# Altium schematic sheet 008_SoC DDR & DDR4.SchDoc
size 420 x 297 mm; Page Create Date: May 29, 2006; WebSite: https://www.seeedstudio.com; Variant Name: <Core Design>; Page Number: 8; Drawing: qxn; Schematic Name: BeaglePlay; Page Size: A3; Comment: Seeed Title; Page Count: 22; Page Name: 008_SoC DDR & DDR4; Company: Seeed Studio; RevCode: v0.2; DsnPath: C:\Users\a0488739\Documents\GitHub\beagleplay\allegro\DVT\BEAGLEPLAYV020_220915.DSN; SchematicName: BeaglePlay; PageName: 008_SoC DDR & DDR4; PageSize: A3; TopSchematic: True
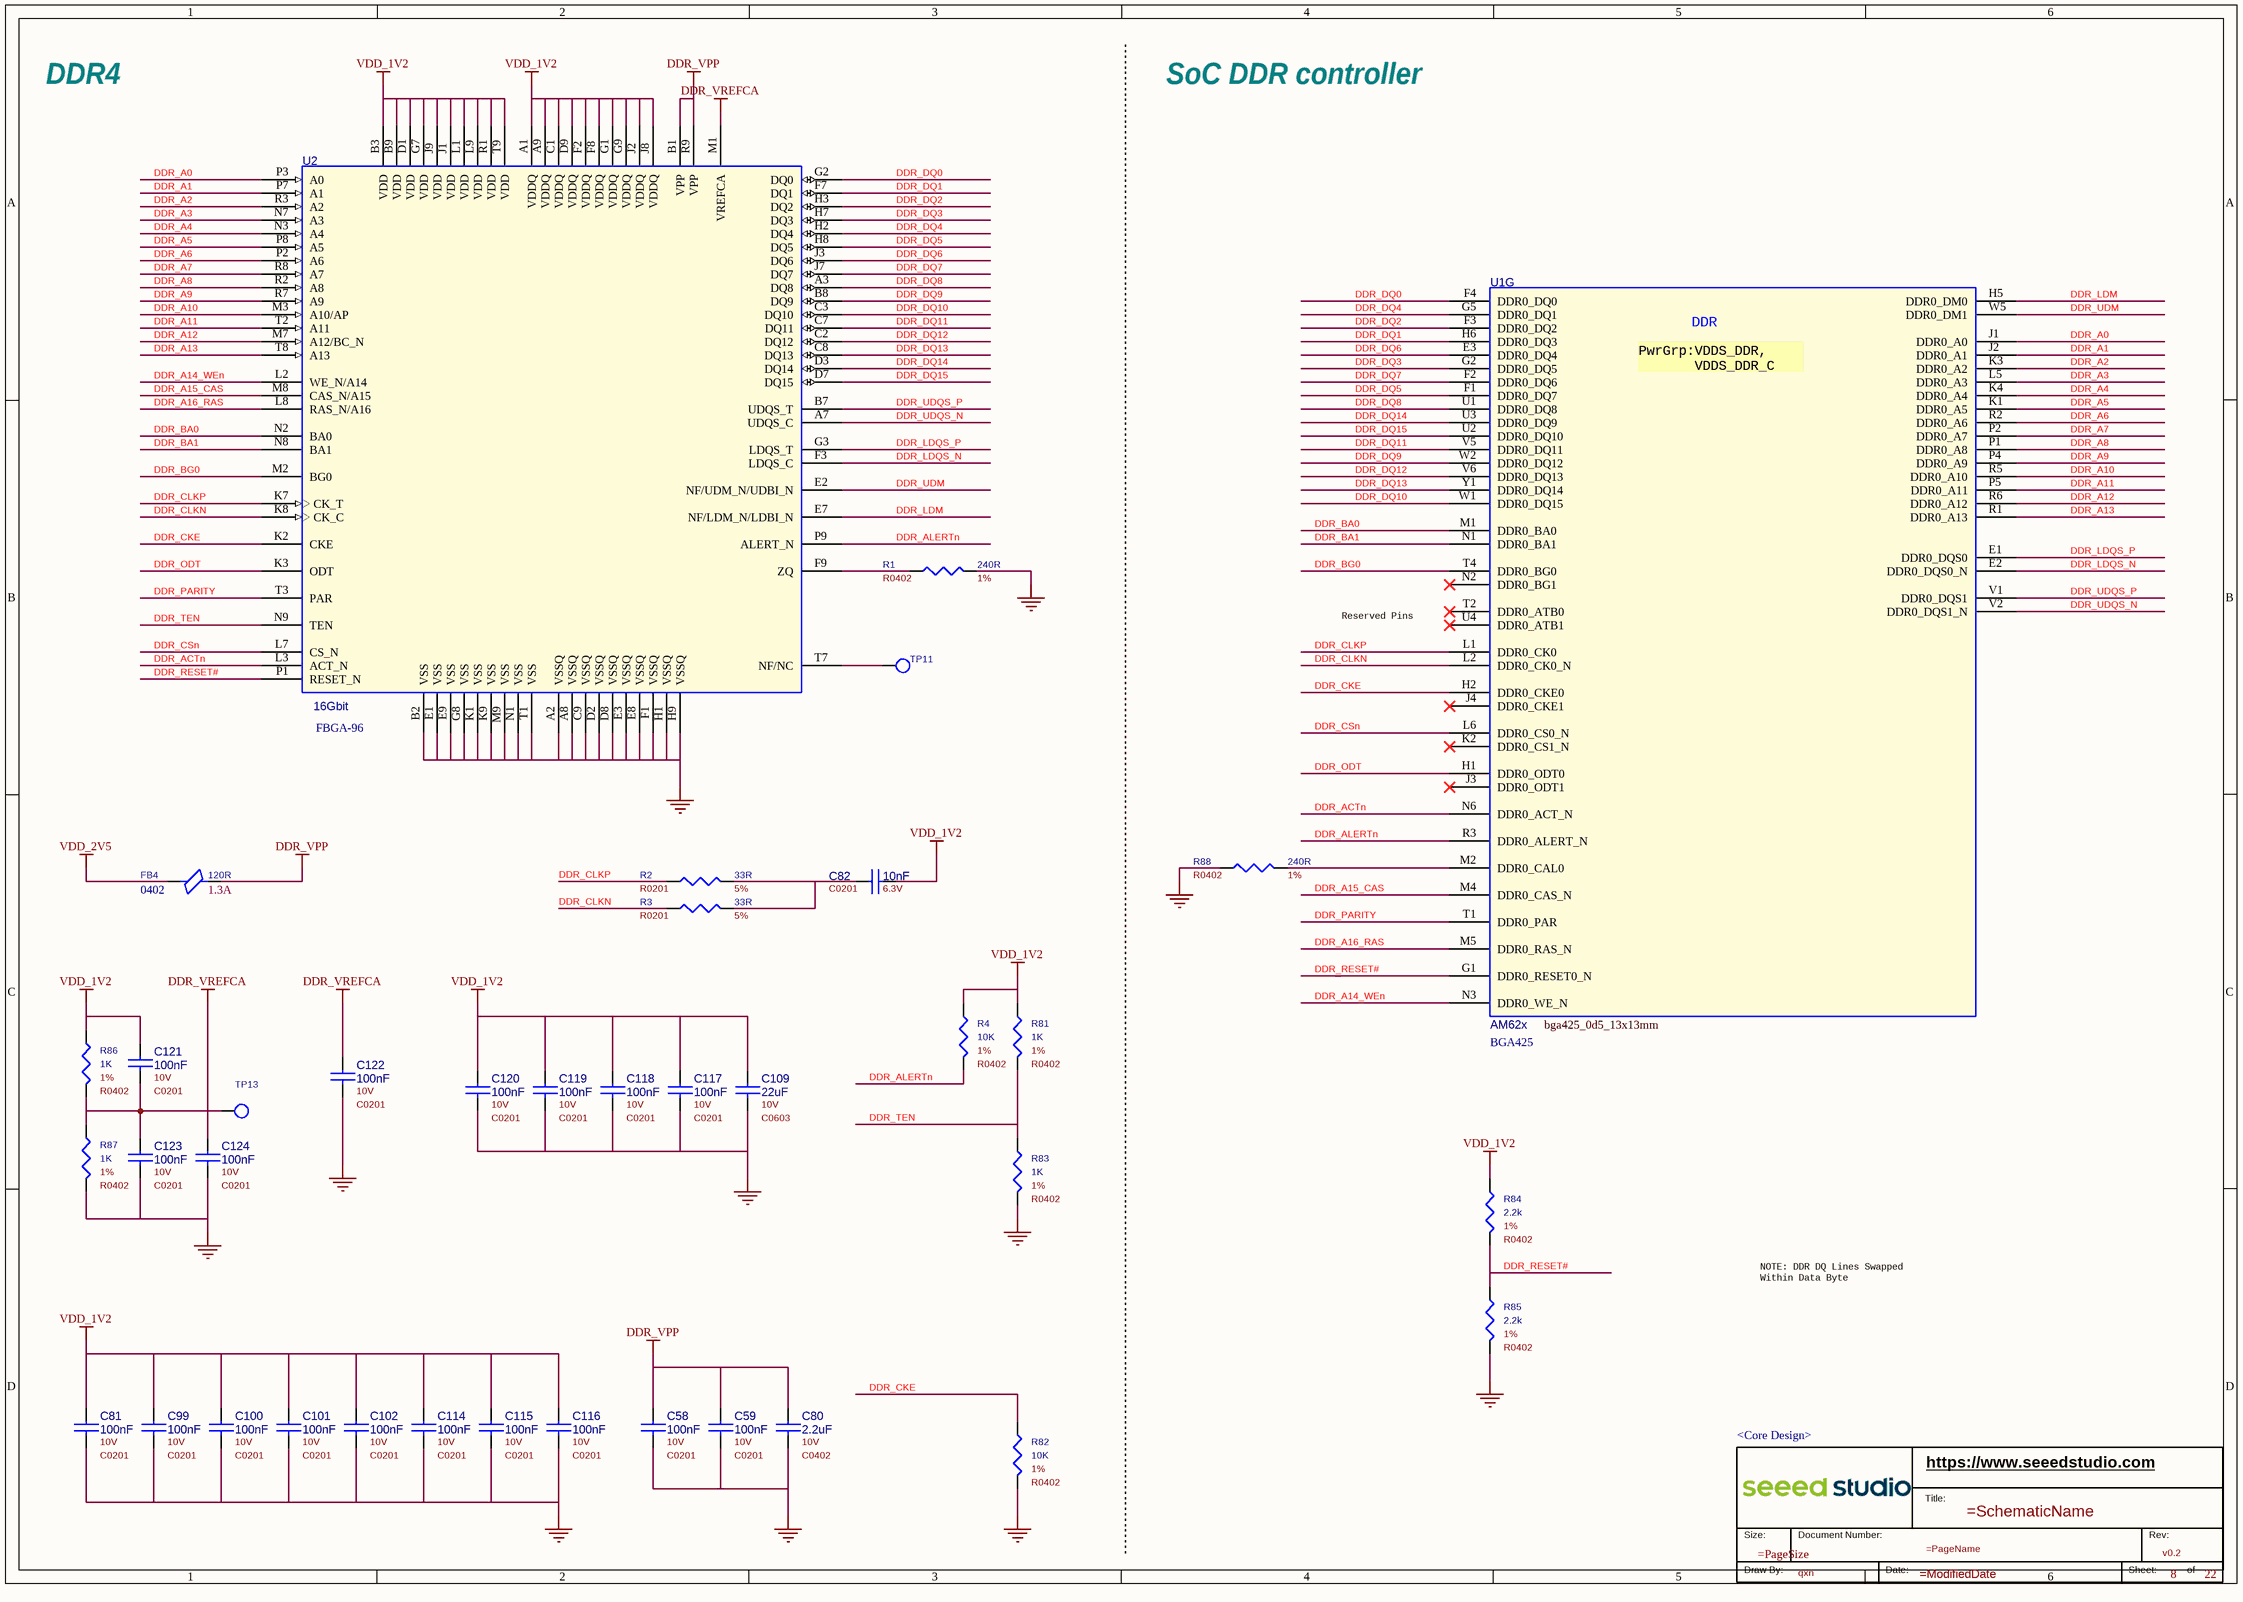
[diagram p0: 008_SoC DDR & DDR4.SchDoc]

## Parts
*  RevCode: v0.2  Page Number: 8  Page Count: 22  Drawing: qxn  Variant Name: <Core Design>  (hidden comment: Seeed Title)  (graphical)
C58  value 100nF  Rating: 10V  [C0201]  (hidden comment: CC)
C59  value 100nF  Rating: 10V  [C0201]  (hidden comment: CC)
C80  value 2.2uF  Rating: 10V  [C0402]  (hidden comment: CC)
C81  value 100nF  Rating: 10V  [C0201]  (hidden comment: CC)
C82  value 10nF  Rating: 6.3V  [C0201]  (hidden comment: CC)
C99  value 100nF  Rating: 10V  [C0201]  (hidden comment: CC)
C100  value 100nF  Rating: 10V  [C0201]  (hidden comment: CC)
C101  value 100nF  Rating: 10V  [C0201]  (hidden comment: CC)
C102  value 100nF  Rating: 10V  [C0201]  (hidden comment: CC)
C109  value 22uF  Rating: 10V  [C0603]  (hidden comment: CC)
C114  value 100nF  Rating: 10V  [C0201]  (hidden comment: CC)
C115  value 100nF  Rating: 10V  [C0201]  (hidden comment: CC)
C116  value 100nF  Rating: 10V  [C0201]  (hidden comment: CC)
C117  value 100nF  Rating: 10V  [C0201]  (hidden comment: CC)
C118  value 100nF  Rating: 10V  [C0201]  (hidden comment: CC)
C119  value 100nF  Rating: 10V  [C0201]  (hidden comment: CC)
C120  value 100nF  Rating: 10V  [C0201]  (hidden comment: CC)
C121  value 100nF  Rating: 10V  [C0201]  (hidden comment: CC)
C122  value 100nF  Rating: 10V  [C0201]  (hidden comment: CC)
C123  value 100nF  Rating: 10V  [C0201]  (hidden comment: CC)
C124  value 100nF  Rating: 10V  [C0201]  (hidden comment: CC)
FB4  value 120R  Rating: 1.3A  Package Size: 0402  [L0402]  (hidden comment: FB)
R1  value 240R  Rating: 1%  [R0402]  (hidden comment: R)
R2  value 33R  Rating: 5%  [R0201]  (hidden comment: R)
R3  value 33R  Rating: 5%  [R0201]  (hidden comment: R)
R4  value 10K  Rating: 1%  [R0402]  (hidden comment: R)
R81  value 1K  Rating: 1%  [R0402]  (hidden comment: R)
R82  value 10K  Rating: 1%  [R0402]  (hidden comment: R)
R83  value 1K  Rating: 1%  [R0402]  (hidden comment: R)
R84  value 2.2k  Rating: 1%  [R0402]  (hidden comment: R)
R85  value 2.2k  Rating: 1%  [R0402]  (hidden comment: R)
R86  value 1K  Rating: 1%  [R0402]  (hidden comment: R)
R87  value 1K  Rating: 1%  [R0402]  (hidden comment: R)
R88  value 240R  Rating: 1%  [R0402]  (hidden comment: R)
TP11  Test Point  [tp1-8040]  (value not drawn)
TP13  Test Point  [tp1-8040]  (value not drawn)
U1  value AM62x  Package Size: BGA425  [bga425_0d5_13x13mm]  (hidden comment: AM62x_BGA425)  (part G of 19)
U2  value 16Gbit  Package Size: FBGA-96  [bga96_t9_p8_10_3x13_3]  (hidden comment: DDR4_FBGA96)

## Nets
DDR_VPP: C58.1 C59.1 C80.1 FB4.2 U2.B1(VPP) U2.R9(VPP)
DDR_VREFCA: C121.2 C122.1 C123.1 C124.1 R86.2 R87.1 TP13.1(TP) U2.M1(VREFCA)
GND: C58.2 C59.2 C80.2 C81.2 C99.2 C100.2 C101.2 C102.2 C109.2 C114.2 C115.2 C116.2 C117.2 C118.2 C119.2 C120.2 C122.2 C123.2 C124.2 R1.2 R82.2 R83.2 R85.2 R87.2 R88.1 U2.A2(VSSQ) U2.A8(VSSQ) U2.B2(VSS) U2.C9(VSSQ) U2.D2(VSSQ) U2.D8(VSSQ) U2.E1(VSS) U2.E3(VSSQ) U2.E8(VSSQ) U2.E9(VSS) U2.F1(VSSQ) U2.G8(VSS) U2.H1(VSSQ) U2.H9(VSSQ) U2.K1(VSS) U2.K9(VSS) U2.M9(VSS) U2.N1(VSS) U2.T1(VSS)
VDD_1V2: C81.1 C82.2 C99.1 C100.1 C101.1 C102.1 C109.1 C114.1 C115.1 C116.1 C117.1 C118.1 C119.1 C120.1 C121.1 R4.1 R81.1 R84.1 R86.1 U2.A1(VDDQ) U2.A9(VDDQ) U2.B3(VDD) U2.B9(VDD) U2.C1(VDDQ) U2.D1(VDD) U2.D9(VDDQ) U2.F2(VDDQ) U2.F8(VDDQ) U2.G1(VDDQ) U2.G7(VDD) U2.G9(VDDQ) U2.J1(VDD) U2.J2(VDDQ) U2.J8(VDDQ) U2.J9(VDD) U2.L1(VDD) U2.L9(VDD) U2.R1(VDD) U2.T9(VDD)
VDD_2V5: FB4.1
DDR_A0: U1.J1(DDR0_A0) U2.P3(A0)
DDR_A1: U1.J2(DDR0_A1) U2.P7(A1)
DDR_A2: U1.K3(DDR0_A2) U2.R3(A2)
DDR_A3: U1.L5(DDR0_A3) U2.N7(A3)
DDR_A4: U1.K4(DDR0_A4) U2.N3(A4)
DDR_A5: U1.K1(DDR0_A5) U2.P8(A5)
DDR_A6: U1.R2(DDR0_A6) U2.P2(A6)
DDR_A7: U1.P2(DDR0_A7) U2.R8(A7)
DDR_A8: U1.P1(DDR0_A8) U2.R2(A8)
DDR_A9: U1.P4(DDR0_A9) U2.R7(A9)
DDR_A10: U1.R5(DDR0_A10) U2.M3(A10/AP)
DDR_A11: U1.P5(DDR0_A11) U2.T2(A11)
DDR_A12: U1.R6(DDR0_A12) U2.M7(A12/BC_N)
DDR_A13: U1.R1(DDR0_A13) U2.T8(A13)
DDR_A14_WEn: U1.N3(DDR0_WE_N) U2.L2(WE_N/A14)
DDR_A15_CAS: U1.M4(DDR0_CAS_N) U2.M8(CAS_N/A15)
DDR_A16_RAS: U1.M5(DDR0_RAS_N) U2.L8(RAS_N/A16)
DDR_ACTn: U1.N6(DDR0_ACT_N) U2.L3(ACT_N)
DDR_ALERTn: R4.2 U1.R3(DDR0_ALERT_N) U2.P9(ALERT_N)
DDR_BA0: U1.M1(DDR0_BA0) U2.N2(BA0)
DDR_BA1: U1.N1(DDR0_BA1) U2.N8(BA1)
DDR_BG0: U1.T4(DDR0_BG0) U2.M2(BG0)
DDR_CKE: R82.1 U1.H2(DDR0_CKE0) U2.K2(CKE)
DDR_CLKN: R3.1 U1.L2(DDR0_CK0_N) U2.K8(CK_C)
DDR_CLKP: R2.1 U1.L1(DDR0_CK0) U2.K7(CK_T)
DDR_CSn: U1.L6(DDR0_CS0_N) U2.L7(CS_N)
DDR_DQ0: U1.F4(DDR0_DQ0) U2.G2(DQ0)
DDR_DQ1: U1.H6(DDR0_DQ3) U2.F7(DQ1)
DDR_DQ2: U1.F3(DDR0_DQ2) U2.H3(DQ2)
DDR_DQ3: U1.G2(DDR0_DQ5) U2.H7(DQ3)
DDR_DQ4: U1.G5(DDR0_DQ1) U2.H2(DQ4)
DDR_DQ5: U1.F1(DDR0_DQ7) U2.H8(DQ5)
DDR_DQ6: U1.E3(DDR0_DQ4) U2.J3(DQ6)
DDR_DQ7: U1.F2(DDR0_DQ6) U2.J7(DQ7)
DDR_DQ8: U1.U1(DDR0_DQ8) U2.A3(DQ8)
DDR_DQ9: U1.W2(DDR0_DQ12) U2.B8(DQ9)
DDR_DQ10: U1.W1(DDR0_DQ15) U2.C3(DQ10)
DDR_DQ11: U1.V5(DDR0_DQ11) U2.C7(DQ11)
DDR_DQ12: U1.V6(DDR0_DQ13) U2.C2(DQ12)
DDR_DQ13: U1.Y1(DDR0_DQ14) U2.C8(DQ13)
DDR_DQ14: U1.U3(DDR0_DQ9) U2.D3(DQ14)
DDR_DQ15: U1.U2(DDR0_DQ10) U2.D7(DQ15)
DDR_LDM: U1.H5(DDR0_DM0) U2.E7(NF/LDM_N/LDBI_N)
DDR_LDQS_N: U1.E2(DDR0_DQS0_N) U2.F3(LDQS_C)
DDR_LDQS_P: U1.E1(DDR0_DQS0) U2.G3(LDQS_T)
DDR_ODT: U1.H1(DDR0_ODT0) U2.K3(ODT)
DDR_PARITY: U1.T1(DDR0_PAR) U2.T3(PAR)
DDR_RESET#: R84.2 R85.1 U1.G1(DDR0_RESET0_N) U2.P1(RESET_N)
DDR_TEN: R81.2 R83.1 U2.N9(TEN)
DDR_UDM: U1.W5(DDR0_DM1) U2.E2(NF/UDM_N/UDBI_N)
DDR_UDQS_N: U1.V2(DDR0_DQS1_N) U2.A7(UDQS_C)
DDR_UDQS_P: U1.V1(DDR0_DQS1) U2.B7(UDQS_T)
NetC82_1: C82.1 R2.2 R3.2
NetR1_1: R1.1 U2.F9(ZQ)
NetR88_2: R88.2 U1.M2(DDR0_CAL0)
NetTP11_1: TP11.1(TP) U2.T7(NF/NC)

Not connected (* = marked no-connect by the designer): U1 J3(DDR0_ODT1)* J4(DDR0_CKE1)* K2(DDR0_CS1_N)* N2(DDR0_BG1)* T2(DDR0_ATB0)* U4(DDR0_ATB1)*

## Notes on the sheet
- DDR4
- SoC DDR controller
- Reserved Pins
- NOTE: DDR DQ Lines Swapped
  Within Data Byte
- (in symbol AM62x_BGA425, part G) DDR; PwrGrp:VDDS_DDR, / VDDS_DDR_C
- (in symbol Seeed Title) https://www.seeedstudio.com; Title:; Size:; Document Number:; Rev:; Draw By:; Date:; Sheet:; of

## Library data of the parts
* = Seeed Title: Company: Seeed Studio; WebSite: https://www.seeedstudio.com; Schematic Name: =SchematicName; Page Size: =PageSize; Page Name: =PageName; Page Create Date: May 29, 2006; Page Modify Date: =ModifiedDate
C58 = CC: CAP, Ceramic, SMD, 100nF, 10%, 10V, 0201; Part Reference: C58; Manufacturer PN: CC0201KRX5R6BB104; Manufacturer: YAGEO; Company Part Status: ODYSSEY-i.MX8M; CLASS: DISCRETE; Temperature Coefficient: X5R; PN: 302010271; SIGNAL_MODEL: DEFAULT_CAPACITOR_100000pF_1_2; PCB Footprint: C0201; Tolerance: 10%; Dielectric Type: Ceramic; Package Size: 0201
C59 = CC: CAP, Ceramic, SMD, 100nF, 10%, 10V, 0201; Part Reference: C59; Company Part Status: ODYSSEY-i.MX8M; Manufacturer: YAGEO; Manufacturer PN: CC0201KRX5R6BB104; SIGNAL_MODEL: DEFAULT_CAPACITOR_100000pF_1_2; PN: 302010271; Temperature Coefficient: X5R; CLASS: DISCRETE; PCB Footprint: C0201; Package Size: 0201; Dielectric Type: Ceramic; Tolerance: 10%
C80 = CC: CAP, Ceramic, SMD, 2.2uF, 10%, 10V, 0402; Part Reference: C80; Manufacturer PN: CC0402KRX5R6BB225; Manufacturer: YAGEO; Company Part Status: BeagleConnect_Robotics_Joystick; CLASS: DISCRETE; Temperature Coefficient: X5R; PN: 302012819; PCB Footprint: C0402; Tolerance: 10%; Dielectric Type: Ceramic; Package Size: 0402
C81 = CC: CAP, Ceramic, SMD, 100nF, 10%, 10V, 0201; Part Reference: C81; Manufacturer PN: CC0201KRX5R6BB104; Manufacturer: YAGEO; Company Part Status: ODYSSEY-i.MX8M; CLASS: DISCRETE; Temperature Coefficient: X5R; PN: 302010271; SIGNAL_MODEL: DEFAULT_CAPACITOR_100000pF_1_2; PCB Footprint: C0201; Tolerance: 10%; Dielectric Type: Ceramic; Package Size: 0201
C82 = CC: CAP, Ceramic, SMD, 10nF, 10%, 6.3V, 0201; Part Reference: C82; Manufacturer PN: CC0201KRX5R5BB103; Manufacturer: YAGEO; Company Part Status: ODYSSEY-i.MX8M; CLASS: DISCRETE; Temperature Coefficient: X5R; PN: 302011831; PCB Footprint: C0201; Tolerance: 10%; Dielectric Type: Ceramic; Package Size: 0201
C99 = CC: CAP, Ceramic, SMD, 100nF, 10%, 10V, 0201; Part Reference: C99; Manufacturer PN: CC0201KRX5R6BB104; Manufacturer: YAGEO; Company Part Status: ODYSSEY-i.MX8M; CLASS: DISCRETE; Temperature Coefficient: X5R; PN: 302010271; SIGNAL_MODEL: DEFAULT_CAPACITOR_100000pF_1_2; PCB Footprint: C0201; Tolerance: 10%; Dielectric Type: Ceramic; Package Size: 0201
C100 = CC: CAP, Ceramic, SMD, 100nF, 10%, 10V, 0201; Part Reference: C100; Company Part Status: ODYSSEY-i.MX8M; Manufacturer: YAGEO; Manufacturer PN: CC0201KRX5R6BB104; SIGNAL_MODEL: DEFAULT_CAPACITOR_100000pF_1_2; PN: 302010271; Temperature Coefficient: X5R; CLASS: DISCRETE; PCB Footprint: C0201; Package Size: 0201; Dielectric Type: Ceramic; Tolerance: 10%
C101 = CC: CAP, Ceramic, SMD, 100nF, 10%, 10V, 0201; Part Reference: C101; Manufacturer PN: CC0201KRX5R6BB104; Manufacturer: YAGEO; Company Part Status: ODYSSEY-i.MX8M; CLASS: DISCRETE; Temperature Coefficient: X5R; PN: 302010271; SIGNAL_MODEL: DEFAULT_CAPACITOR_100000pF_1_2; PCB Footprint: C0201; Tolerance: 10%; Dielectric Type: Ceramic; Package Size: 0201
C102 = CC: CAP, Ceramic, SMD, 100nF, 10%, 10V, 0201; Part Reference: C102; Manufacturer PN: CC0201KRX5R6BB104; Manufacturer: YAGEO; Company Part Status: ODYSSEY-i.MX8M; CLASS: DISCRETE; Temperature Coefficient: X5R; PN: 302010271; SIGNAL_MODEL: DEFAULT_CAPACITOR_100000pF_1_2; PCB Footprint: C0201; Tolerance: 10%; Dielectric Type: Ceramic; Package Size: 0201
C109 = CC: CAP, Ceramic, SMD, 22uF, 20%, 10V, 0603; Part Reference: C109; Manufacturer PN: CC0603MRX5R6BB226; Manufacturer: YAGEO; CLASS: DISCRETE; Temperature Coefficient: X5R; PN: 302010411; PCB Footprint: C0603; Tolerance: 20%; Dielectric Type: Ceramic; Package Size: 0603
C114 = CC: CAP, Ceramic, SMD, 100nF, 10%, 10V, 0201; Part Reference: C114; Manufacturer PN: CC0201KRX5R6BB104; Manufacturer: YAGEO; Company Part Status: ODYSSEY-i.MX8M; CLASS: DISCRETE; Temperature Coefficient: X5R; PN: 302010271; SIGNAL_MODEL: DEFAULT_CAPACITOR_100000pF_1_2; PCB Footprint: C0201; Tolerance: 10%; Dielectric Type: Ceramic; Package Size: 0201
C115 = CC: CAP, Ceramic, SMD, 100nF, 10%, 10V, 0201; Part Reference: C115; Manufacturer PN: CC0201KRX5R6BB104; Manufacturer: YAGEO; Company Part Status: ODYSSEY-i.MX8M; CLASS: DISCRETE; Temperature Coefficient: X5R; PN: 302010271; SIGNAL_MODEL: DEFAULT_CAPACITOR_100000pF_1_2; PCB Footprint: C0201; Tolerance: 10%; Dielectric Type: Ceramic; Package Size: 0201
C116 = CC: CAP, Ceramic, SMD, 100nF, 10%, 10V, 0201; Part Reference: C116; Company Part Status: ODYSSEY-i.MX8M; Manufacturer: YAGEO; Manufacturer PN: CC0201KRX5R6BB104; SIGNAL_MODEL: DEFAULT_CAPACITOR_100000pF_1_2; PN: 302010271; Temperature Coefficient: X5R; CLASS: DISCRETE; PCB Footprint: C0201; Package Size: 0201; Dielectric Type: Ceramic; Tolerance: 10%
C117 = CC: CAP, Ceramic, SMD, 100nF, 10%, 10V, 0201; Part Reference: C117; Company Part Status: ODYSSEY-i.MX8M; Manufacturer: YAGEO; Manufacturer PN: CC0201KRX5R6BB104; SIGNAL_MODEL: DEFAULT_CAPACITOR_100000pF_1_2; PN: 302010271; Temperature Coefficient: X5R; CLASS: DISCRETE; PCB Footprint: C0201; Package Size: 0201; Dielectric Type: Ceramic; Tolerance: 10%
C118 = CC: CAP, Ceramic, SMD, 100nF, 10%, 10V, 0201; Part Reference: C118; Manufacturer PN: CC0201KRX5R6BB104; Manufacturer: YAGEO; Company Part Status: ODYSSEY-i.MX8M; CLASS: DISCRETE; Temperature Coefficient: X5R; PN: 302010271; SIGNAL_MODEL: DEFAULT_CAPACITOR_100000pF_1_2; PCB Footprint: C0201; Tolerance: 10%; Dielectric Type: Ceramic; Package Size: 0201
C119 = CC: CAP, Ceramic, SMD, 100nF, 10%, 10V, 0201; Part Reference: C119; Company Part Status: ODYSSEY-i.MX8M; Manufacturer: YAGEO; Manufacturer PN: CC0201KRX5R6BB104; SIGNAL_MODEL: DEFAULT_CAPACITOR_100000pF_1_2; PN: 302010271; Temperature Coefficient: X5R; CLASS: DISCRETE; PCB Footprint: C0201; Package Size: 0201; Dielectric Type: Ceramic; Tolerance: 10%
C120 = CC: CAP, Ceramic, SMD, 100nF, 10%, 10V, 0201; Part Reference: C120; Manufacturer PN: CC0201KRX5R6BB104; Manufacturer: YAGEO; Company Part Status: ODYSSEY-i.MX8M; CLASS: DISCRETE; Temperature Coefficient: X5R; PN: 302010271; SIGNAL_MODEL: DEFAULT_CAPACITOR_100000pF_1_2; PCB Footprint: C0201; Tolerance: 10%; Dielectric Type: Ceramic; Package Size: 0201
C121 = CC: CAP, Ceramic, SMD, 100nF, 10%, 10V, 0201; Part Reference: C121; Company Part Status: ODYSSEY-i.MX8M; Manufacturer: YAGEO; Manufacturer PN: CC0201KRX5R6BB104; SIGNAL_MODEL: DEFAULT_CAPACITOR_100000pF_1_2; PN: 302010271; Temperature Coefficient: X5R; CLASS: DISCRETE; PCB Footprint: C0201; Package Size: 0201; Dielectric Type: Ceramic; Tolerance: 10%
C122 = CC: CAP, Ceramic, SMD, 100nF, 10%, 10V, 0201; Part Reference: C122; Manufacturer PN: CC0201KRX5R6BB104; Manufacturer: YAGEO; Company Part Status: ODYSSEY-i.MX8M; CLASS: DISCRETE; Temperature Coefficient: X5R; PN: 302010271; SIGNAL_MODEL: DEFAULT_CAPACITOR_100000pF_1_2; PCB Footprint: C0201; Tolerance: 10%; Dielectric Type: Ceramic; Package Size: 0201
C123 = CC: CAP, Ceramic, SMD, 100nF, 10%, 10V, 0201; Part Reference: C123; Company Part Status: ODYSSEY-i.MX8M; Manufacturer: YAGEO; Manufacturer PN: CC0201KRX5R6BB104; SIGNAL_MODEL: DEFAULT_CAPACITOR_100000pF_1_2; PN: 302010271; Temperature Coefficient: X5R; CLASS: DISCRETE; PCB Footprint: C0201; Package Size: 0201; Dielectric Type: Ceramic; Tolerance: 10%
C124 = CC: CAP, Ceramic, SMD, 100nF, 10%, 10V, 0201; Part Reference: C124; Company Part Status: ODYSSEY-i.MX8M; Manufacturer: YAGEO; Manufacturer PN: CC0201KRX5R6BB104; SIGNAL_MODEL: DEFAULT_CAPACITOR_100000pF_1_2; PN: 302010271; Temperature Coefficient: X5R; CLASS: DISCRETE; PCB Footprint: C0201; Package Size: 0201; Dielectric Type: Ceramic; Tolerance: 10%
FB4 = FB: Ferrite Bead, 120R, , 1.3A, 0402; Part Reference: FB4; Company Part Status: BeagleBone Carrier Board; Manufacturer: Murata; Manufacturer PN: BLM15PD121SN1D; PN: 303030040; CLASS: DISCRETE; PCB Footprint: L0402
R1 = R: RES, Thick Film, 240R, 1%, 1/16W, SMD, 0402; Part Reference: R1; Manufacturer PN: RC0402FR-07240RL; Manufacturer: YAGEO; Company Part Status: Combox Pro; CLASS: DISCRETE; PN: 301011475; PCB Footprint: R0402; Rated Power: 1/16W; Package Size: 0402
R2 = R: RES, Thick Film, 33R, 5%, 1/20W, SMD, 0201; Part Reference: R2; Company Part Status: BeagleBone Carrier Board; Manufacturer: YAGEO; Manufacturer PN: RC0201JR-0733RL; PN: 301010675; CLASS: DISCRETE; PCB Footprint: R0201; Package Size: 0201; Rated Power: 1/20W
R3 = R: RES, Thick Film, 33R, 5%, 1/20W, SMD, 0201; Part Reference: R3; Manufacturer PN: RC0201JR-0733RL; Manufacturer: YAGEO; Company Part Status: BeagleBone Carrier Board; CLASS: DISCRETE; PN: 301010675; PCB Footprint: R0201; Rated Power: 1/20W; Package Size: 0201
R4 = R: RES, Thick Film, 10K, 1%, 1/16W, SMD, 0402; Part Reference: R4; Manufacturer PN: RC0402FR-0710KL; Manufacturer: YAGEO; Company Part Status: BeagleBone Carrier Board; CLASS: DISCRETE; PN: 301010047; PCB Footprint: R0402; Package Size: 0402; Rated Power: 1/16W
R81 = R: RES, Thick Film, 1K, 1%, 1/16W, SMD, 0402; Part Reference: R81; Company Part Status: Combox Pro; Manufacturer: YAGEO; Manufacturer PN: RC0402FR-071KL; PN: 301010044; CLASS: DISCRETE; PCB Footprint: R0402; Package Size: 0402; Rated Power: 1/16W
R82 = R: RES, Thick Film, 10K, 1%, 1/16W, SMD, 0402; Part Reference: R82; Manufacturer PN: RC0402FR-0710KL; Manufacturer: YAGEO; Company Part Status: BeagleBone Carrier Board; CLASS: DISCRETE; PN: 301010047; PCB Footprint: R0402; Package Size: 0402; Rated Power: 1/16W
R83 = R: RES, Thick Film, 1K, 1%, 1/16W, SMD, 0402; Part Reference: R83; Company Part Status: Combox Pro; Manufacturer: YAGEO; Manufacturer PN: RC0402FR-071KL; PN: 301010044; CLASS: DISCRETE; PCB Footprint: R0402; Package Size: 0402; Rated Power: 1/16W
R84 = R: RES, Thick Film, 2.2k, 1%, 1/16W, SMD, 0402; Part Reference: R84; Manufacturer PN: RC0402FR-072K2L; Manufacturer: YAGEO; Company Part Status: ST; CLASS: DISCRETE; PN: 301010746; PCB Footprint: R0402; Rated Power: 1/16W; Package Size: 0402
R85 = R: RES, Thick Film, 2.2k, 1%, 1/16W, SMD, 0402; Part Reference: R85; Manufacturer PN: RC0402FR-072K2L; Manufacturer: YAGEO; Company Part Status: ST; CLASS: DISCRETE; PN: 301010746; PCB Footprint: R0402; Rated Power: 1/16W; Package Size: 0402
R86 = R: RES, Thick Film, 1K, 1%, 1/16W, SMD, 0402; Part Reference: R86; Company Part Status: Combox Pro; Manufacturer: YAGEO; Manufacturer PN: RC0402FR-071KL; PN: 301010044; CLASS: DISCRETE; PCB Footprint: R0402; Package Size: 0402; Rated Power: 1/16W
R87 = R: RES, Thick Film, 1K, 1%, 1/16W, SMD, 0402; Part Reference: R87; Manufacturer PN: RC0402FR-071KL; Manufacturer: YAGEO; Company Part Status: Combox Pro; CLASS: DISCRETE; PN: 301010044; PCB Footprint: R0402; Rated Power: 1/16W; Package Size: 0402
R88 = R: RES, Thick Film, 240R, 1%, 1/16W, SMD, 0402; Part Reference: R88; Company Part Status: Combox Pro; Manufacturer: YAGEO; Manufacturer PN: RC0402FR-07240RL; PN: 301011475; CLASS: DISCRETE; PCB Footprint: R0402; Package Size: 0402; Rated Power: 1/16W
TP11 = Test Point: MISC, Test Point, Test Point, SMD, TP35S_SMD; Part Reference: TP11; Company Part Status: Mini-Gateway; ASSY: DNP; CLASS: DISCRETE; PCB Footprint: TP35S_SMD; Value: Test Point; Package Size: TP35S_SMD; PN: TP35S_SMD
TP13 = Test Point: MISC, Test Point, Test Point, SMD, TP35S_SMD; Part Reference: TP13; Company Part Status: Mini-Gateway; ASSY: DNP; CLASS: DISCRETE; PCB Footprint: TP35S_SMD; Value: Test Point; Package Size: TP35S_SMD; PN: TP35S_SMD
U1 = AM62x_BGA425: IC, Controller, MPU, AM62x, BGA425; Part Reference: U1; Company Part Status: BeaglePlay; Manufacturer: TI; Manufacturer PN: AM6254ATCGGHALWR; PN: 310011537; PCB Footprint: bga425_0d5_13x13mm; CLASS: IC
U2 = DDR4_FBGA96: IC, Memory Devices, DDR, 16Gbit, FBGA-96; Part Reference: U2; Manufacturer PN: K4AAG165WA-BCWE; Manufacturer: Samsung; Company Part Status: BeaglePlay; PN: 310091406; PCB Footprint: bga96_t9_p8_10_3x13_3; CLASS: IC